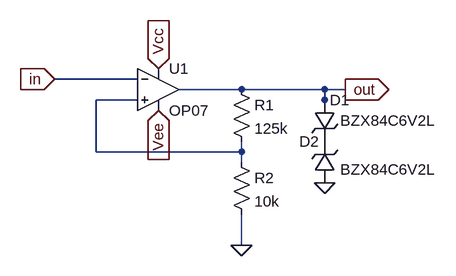
[diagram p0: schematic schmitt_trigger.asc]
schmitt_trigger.asc, the LTspice schematic file:
Version 4.1
SHEET 1 992 680
WIRE 96 64 -32 64
WIRE 256 80 160 80
WIRE 384 80 256 80
WIRE 416 80 384 80
WIRE 96 96 32 96
WIRE 384 96 384 80
WIRE 384 112 384 96
WIRE 32 176 32 96
WIRE 256 176 256 160
WIRE 256 176 32 176
WIRE 256 192 256 176
WIRE 256 320 256 272
FLAG 128 48 Vcc
IOPIN 128 48 In
FLAG 128 112 Vee
IOPIN 128 112 In
FLAG 256 320 0
FLAG 416 80 out
IOPIN 416 80 Out
FLAG -32 64 in
IOPIN -32 64 In
FLAG 384 224 0
SYMBOL OpAmps\\OP07 128 16 R0
SYMATTR InstName U1
SYMBOL res 240 64 R0
SYMATTR InstName R1
SYMATTR Value 125k
SYMBOL res 240 176 R0
SYMATTR InstName R2
SYMATTR Value 10k
SYMBOL zener 368 96 R0
WINDOW 3 40 32 Left 2
SYMATTR InstName D1
SYMATTR Value BZX84C6V2L
SYMBOL zener 400 224 R180
WINDOW 0 24 64 Left 2
WINDOW 3 -155 21 Left 2
SYMATTR InstName D2
SYMATTR Value BZX84C6V2L

The netlist it stands for:
* schmitt_trigger.asc
X§U1 N001 in Vcc Vee out LT1001  ; OP07, pins In+ In- V+ V- OUT
R1 out N001 125k
R2 N001 0 10k
D1 out P001 BZX84C6V2L
D2 0 P001 BZX84C6V2L
.model D D
.lib standard.dio
.lib LTC.lib
.backanno
.end